# EAGLE design rz568m-test-v1 (EAGLE 7.7.0)
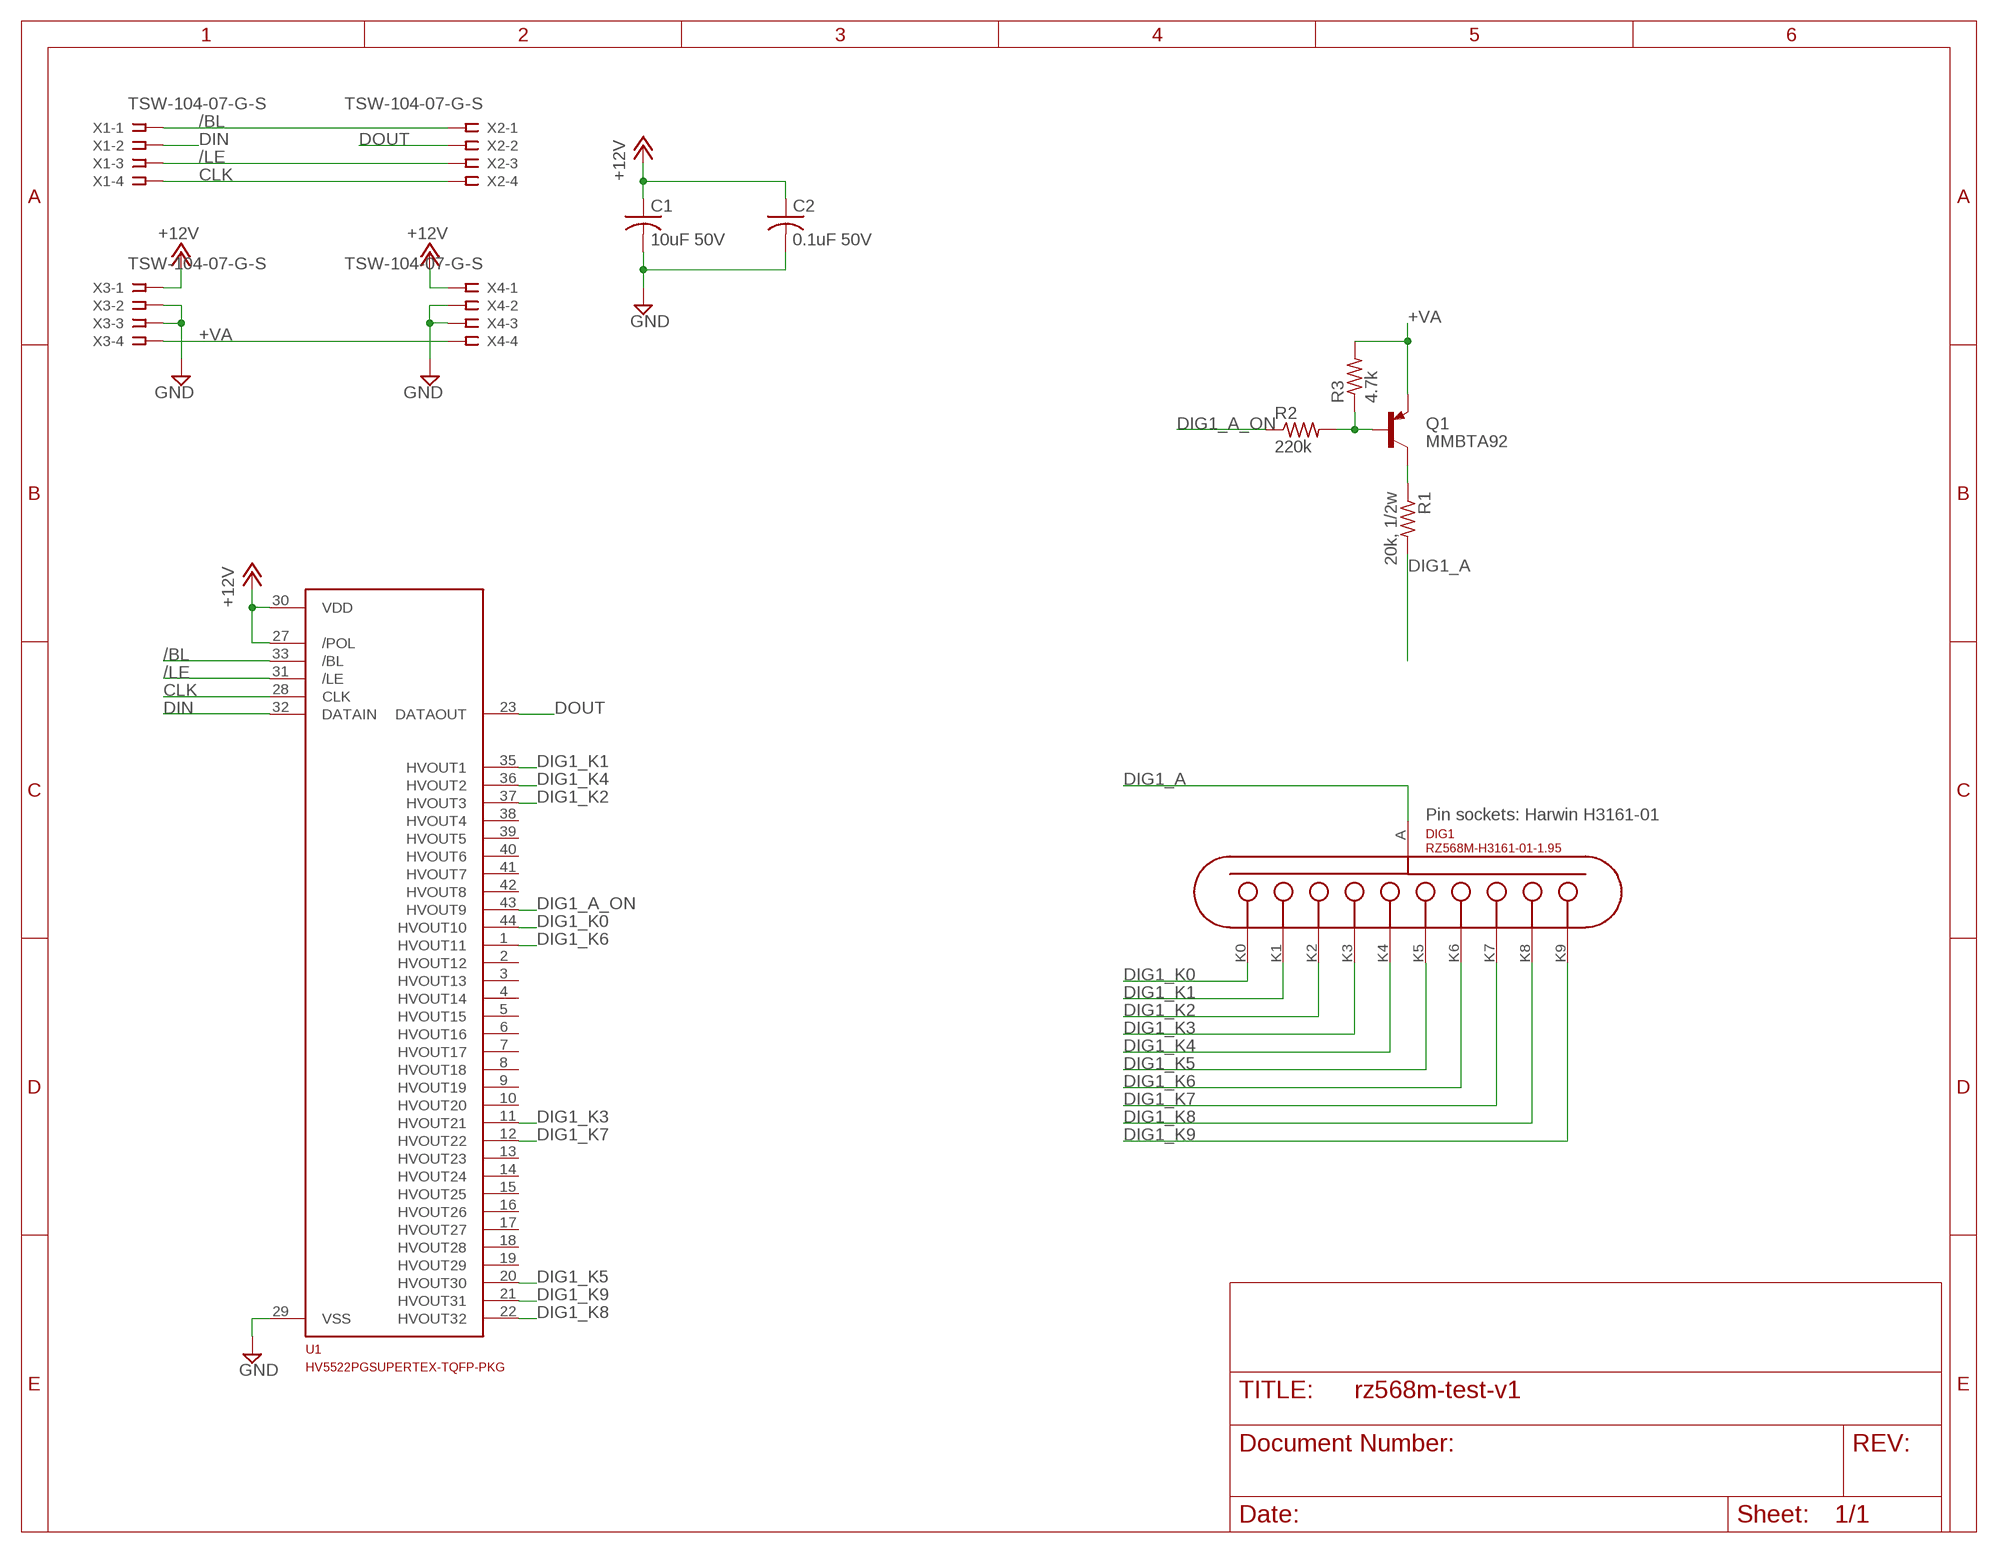
[diagram p0: schematic, sheet 1]

## Parts
C1  10uF 50V  C-USC1210K  [C1210K]
C2  0.1uF 50V  C-USC1206K  [C1206K]
DIG1  RZ568M-H3161-01-1.95  [RZ568M-H3161-01-1.95]
Q1  MMBTA92  MMBTA92LT1-PNP-SOT23-BEC  [SOT23-BEC]
R1  20k, 1/2w  R-US_R1210  [R1210]
R2  220k  R-US_R1206  [R1206]
R3  4.7k  R-US_R1206  [R1206]
U1  HV5522PGSUPERTEX-TQFP-PKG  [TQFP44-HV5522PG]
X1  TSW-104-07-G-S  SSW-104-02-S-S  [SSW-104-02-S-S]
X2  TSW-104-07-G-S  SSW-104-02-S-S  [SSW-104-02-S-S]
X3  TSW-104-07-G-S  SSW-104-02-S-S  [SSW-104-02-S-S]
X4  TSW-104-07-G-S  SSW-104-02-S-S  [SSW-104-02-S-S]

## Nets
+12V: C1.1 C2.1 U1.27(/POL) U1.30(VDD) X3.1 X4.1
+VA: Q1.E R3.2 X3.4 X4.4
/BL: U1.33(/BL) X1.1 X2.1
/LE: U1.31(/LE) X1.3 X2.3
CLK: U1.28(CLK) X1.4 X2.4
DIG1_A: DIG1.A R1.2
DIG1_A_ON: R2.1 U1.43(HVOUT9)
DIG1_BASE: Q1.B R2.2 R3.1
DIG1_COLLECTOR: Q1.C R1.1
DIG1_K0: DIG1.K0 U1.44(HVOUT10)
DIG1_K1: DIG1.K1 U1.35(HVOUT1)
DIG1_K2: DIG1.K2 U1.37(HVOUT3)
DIG1_K3: DIG1.K3 U1.11(HVOUT21)
DIG1_K4: DIG1.K4 U1.36(HVOUT2)
DIG1_K5: DIG1.K5 U1.20(HVOUT30)
DIG1_K6: DIG1.K6 U1.1(HVOUT11)
DIG1_K7: DIG1.K7 U1.12(HVOUT22)
DIG1_K8: DIG1.K8 U1.22(HVOUT32)
DIG1_K9: DIG1.K9 U1.21(HVOUT31)
DIN: U1.32(DATAIN) X1.2
DOUT: U1.23(DATAOUT) X2.2
GND: C1.2 C2.2 U1.29(VSS) X3.2 X3.3 X4.2 X4.3
Unconnected: U1.2(HVOUT12) U1.3(HVOUT13) U1.4(HVOUT14) U1.5(HVOUT15) U1.6(HVOUT16) U1.7(HVOUT17) U1.8(HVOUT18) U1.9(HVOUT19) U1.10(HVOUT20) U1.13(HVOUT23) U1.14(HVOUT24) U1.15(HVOUT25) U1.16(HVOUT26) U1.17(HVOUT27) U1.18(HVOUT28) U1.19(HVOUT29) U1.38(HVOUT4) U1.39(HVOUT5) U1.40(HVOUT6) U1.41(HVOUT7) U1.42(HVOUT8)

## Notes on the sheet
- Pin sockets: Harwin H3161-01

## Library data of the parts
C1 = rcl:C-US: CAPACITOR, American symbol; MFR: KEMET; MFR_PART_NO: C1210C106K5RACTU
C2 = rcl:C-US: CAPACITOR, American symbol; MFR: KEMET; MFR_PART_NO: C1206S104M5RACTU
DIG1 = RZ568M:RZ568M-H3161-01-1.95; MFR: HARWIN; MFR_PART_NO: H3161-01
Q1 = transistor:*-PNP-: PNP Transistror; MFR: ON SEMI; MFR_PART_NO: MMBTA92
R1 = rcl:R-US_: RESISTOR, American symbol; MFR: PANASONIC; MFR_PART_NO: ERJ-14NF2002U
R2 = rcl:R-US_: RESISTOR, American symbol; MFR: PANASONIC; MFR_PART_NO: ERJ-8GEYJ224V
R3 = rcl:R-US_: RESISTOR, American symbol; MFR: PANASONIC; MFR_PART_NO: ERJ-8ENF4701V
U1 = GlenPartsLibrary:HV5522PG; MFR: MICROCHIP; MFR_PART_NO: HV5522PG
X1-X4 = con-samtec:SSW-104-02-S-S: THROUGH-HOLE .025" SQ POST SOCKET Source: Samtec SSW.pdf; MFR: SAMTEC; MFR_PART_NO: TSW-104-07-G-S; MPN: SSW-104-02-S-S; OC_FARNELL: unknown; OC_NEWARK: 11P9384

## Board
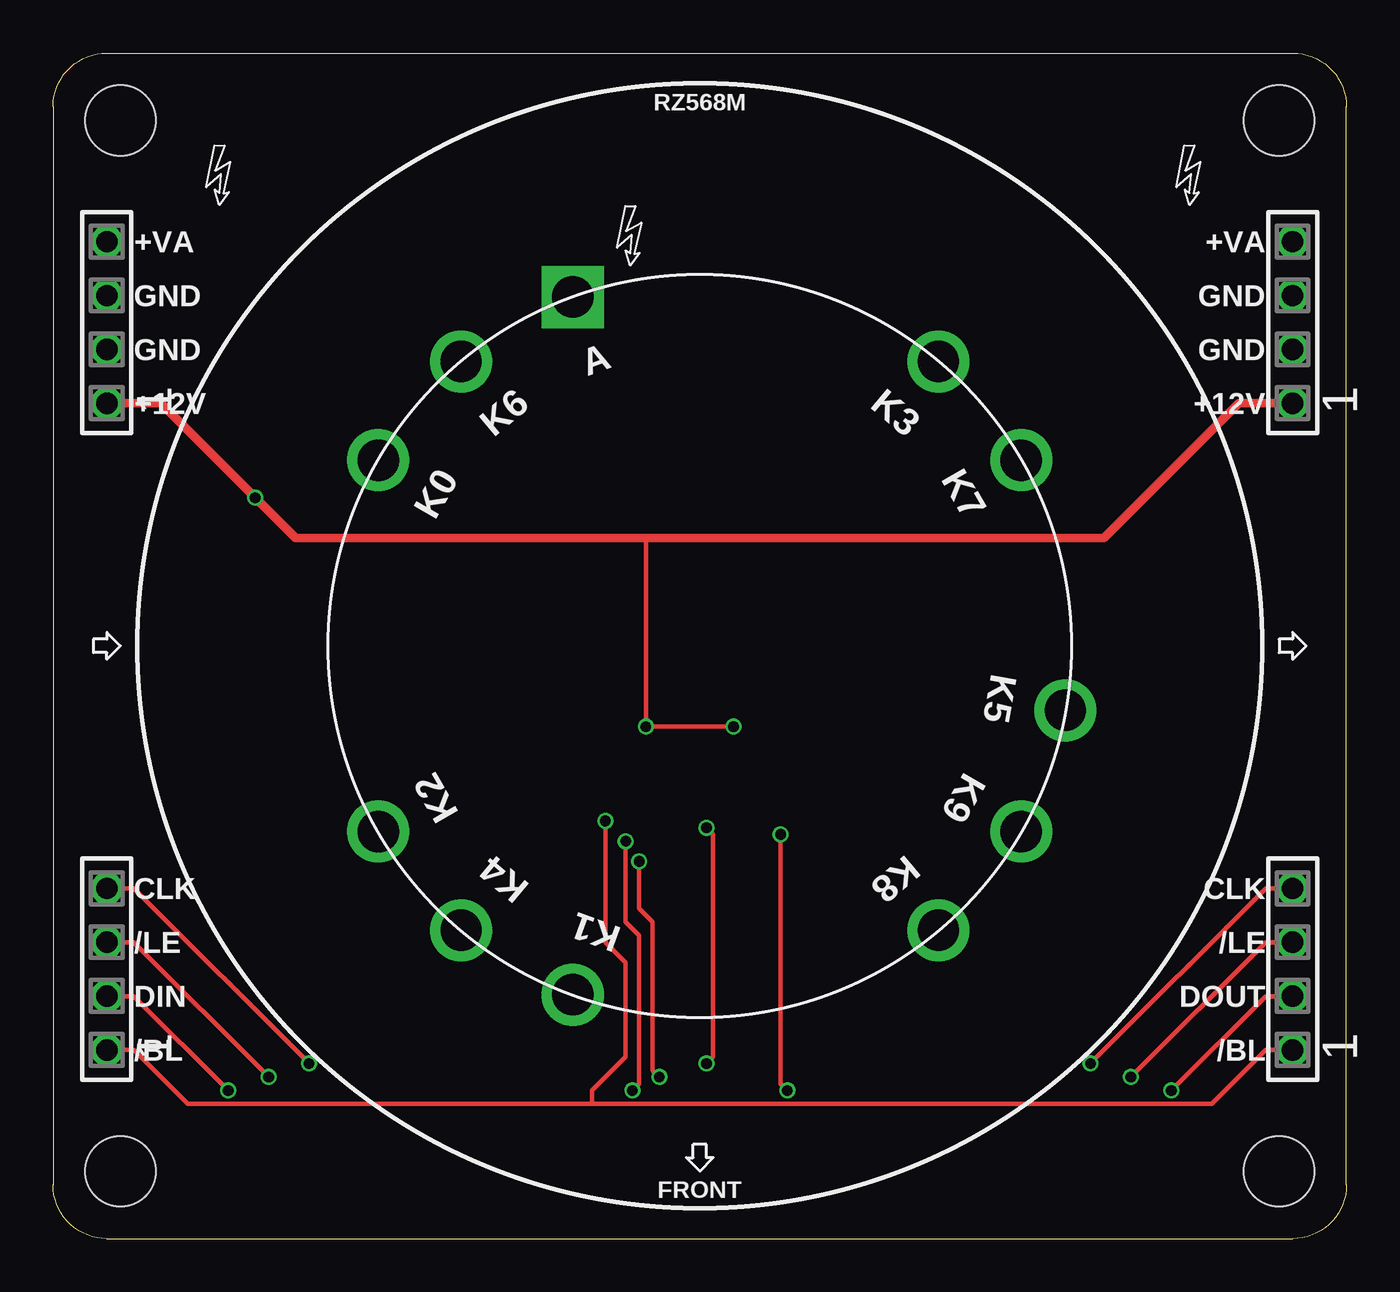
[diagram p1: board, top side]
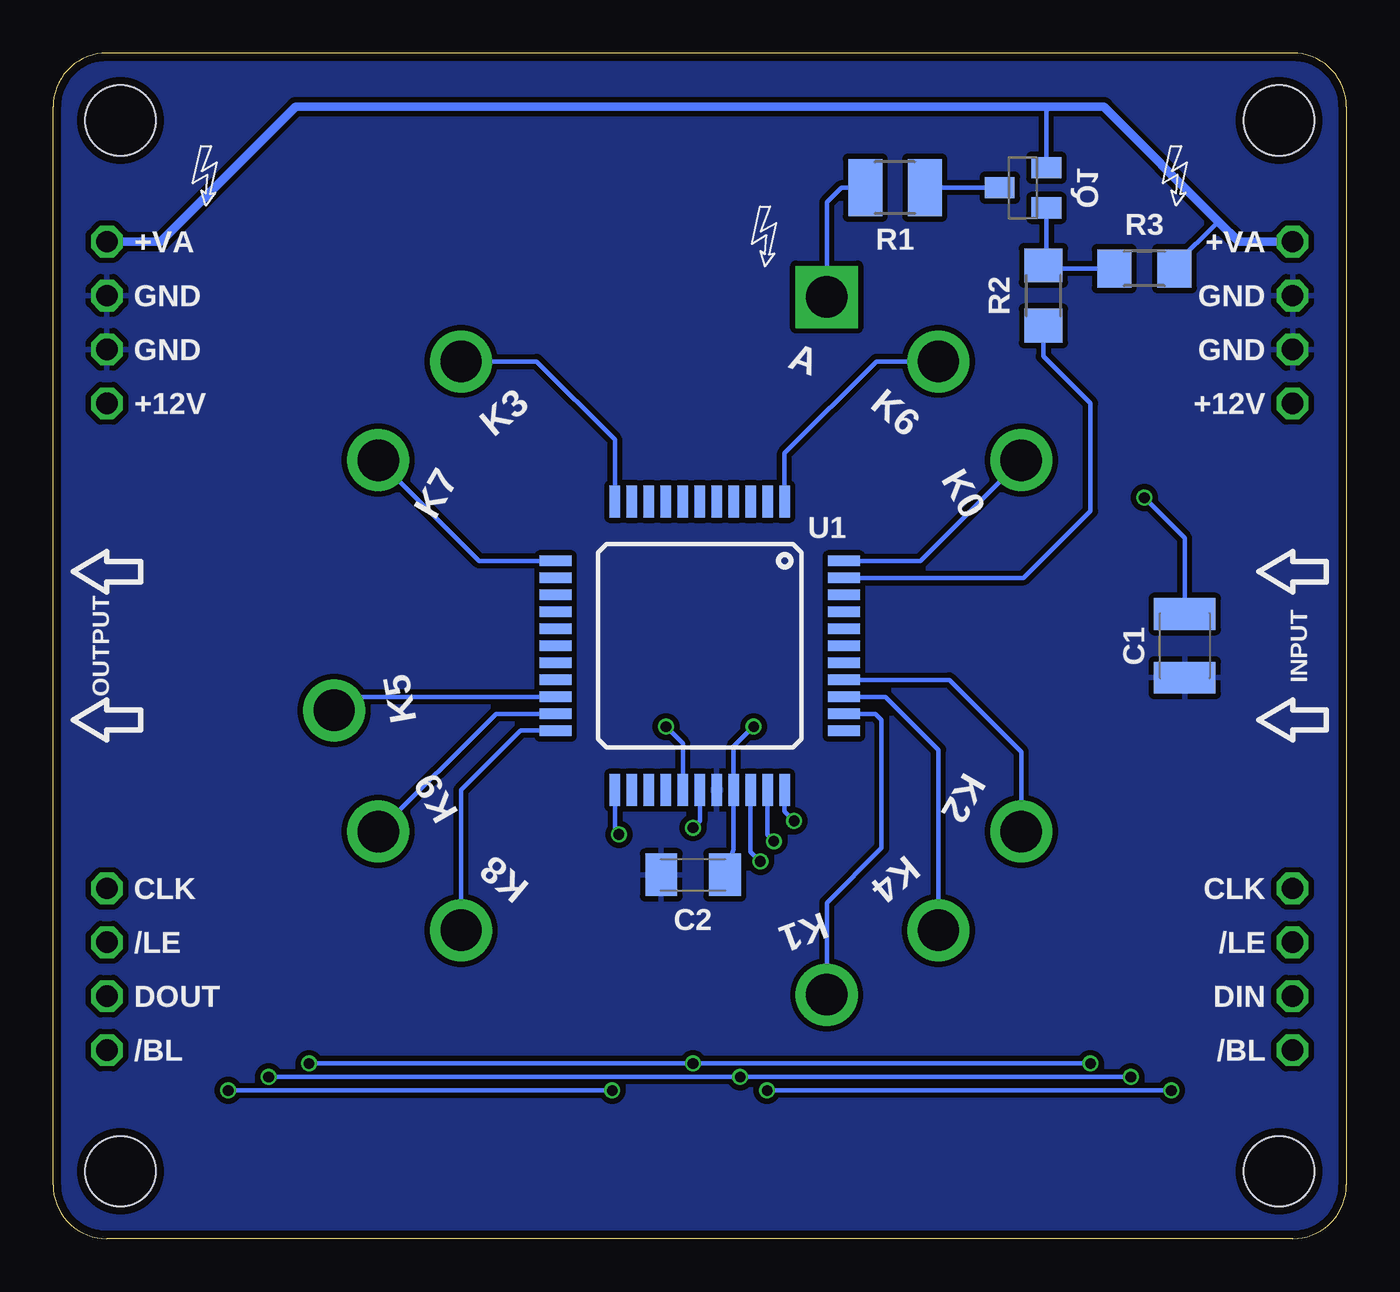
[diagram p2: board, bottom side, seen from below]

Size 60.96 x 55.88 mm. Coordinates in mm from the lower left corner, seen from the top.
Outline: 2.54,0 58.42,0 arc90 60.96,2.54 60.96,53.34 arc90 58.42,55.88 2.54,55.88 arc90 0,53.34 0,2.54 arc90 2.54,0
Copper layers (1*16): Top 0.035559375mm / dielectric 1.6mm / Bottom 0.035559375mm
Design rules "oshpark-2layer-2018": minimum track width 6mil, minimum drill 10mil, track to track 6mil, track to pad 6mil, pad to pad 6mil, via to via 6mil, smd to smd 6mil, copper to edge 15mil, drill to drill 6mil, minimum pad ring 5mil, minimum via ring 5mil, stop-mask expansion 2.5mil, vias tented up to drill 0mil, thermal gap 10mil
Holes 3.3 mm at 3.17,3.17 57.78,3.17 57.78,52.7 3.17,52.7

### Footprints (pad centres in the part's own frame; a part is rotated, then mirrored left to right if it is on the bottom)
C1210K = smd 1.5 x 2.9: 1 -1.5,0; 2 1.5,0
C1206K = smd 1.5 x 2: 1 -1.5,0; 2 1.5,0
RZ568M-H3161-01-1.95 = drill 1.95 square: A -5.985,16.445 | drill 1.95: K0 -15.155,8.75; K1 -5.985,-16.445; K2 -15.155,-8.75; K3 11.249,13.406; K4 -11.249,-13.406; K5 17.234,-3.039; K6 -11.249,13.406; K7 15.155,8.75; K8 11.249,-13.406; K9 15.155,-8.75
SOT23-BEC = smd 1 x 1.4: B -0.95,-1.1; C 0,1.1; E 0.95,-1.1
R1210 = smd 1.6 x 2.7: 1 -1.4,0; 2 1.4,0
R1206 = smd 1.6 x 1.803: 1 -1.422,0; 2 1.422,0
TQFP44-HV5522PG = smd 1.5 x 0.5: 1 -6.8,4; 2 -6.8,3.2; 3 -6.8,2.4; 4 -6.8,1.6; 5 -6.8,0.8; 6 -6.8,0; 7 -6.8,-0.8; 8 -6.8,-1.6; 9 -6.8,-2.4; 10 -6.8,-3.2; 11 -6.8,-4; 23 6.8,-4; 24 6.8,-3.2; 25 6.8,-2.4; 26 6.8,-1.6; 27 6.8,-0.8; 28 6.8,0; 29 6.8,0.8; 30 6.8,1.6; 31 6.8,2.4; 32 6.8,3.2; 33 6.8,4 | smd 0.5 x 1.5: 12 -4,-6.8; 13 -3.2,-6.8; 14 -2.4,-6.8; 15 -1.6,-6.8; 16 -0.8,-6.8; 17 0,-6.8; 18 0.8,-6.8; 19 1.6,-6.8; 20 2.4,-6.8; 21 3.2,-6.8; 22 4,-6.8; 34 4,6.8; 35 3.2,6.8; 36 2.4,6.8; 37 1.6,6.8; 38 0.8,6.8; 39 0,6.8; 40 -0.8,6.8; 41 -1.6,6.8; 42 -2.4,6.8; 43 -3.2,6.8; 44 -4,6.8
SSW-104-02-S-S = drill 1 pad 1.5 octagon: 1 -3.81,0; 2 -1.27,0; 3 1.27,0; 4 3.81,0

### Placement (x,y rotation side)
C1  7.62,27.94 270 bottom
C2  30.8,17.14 180 bottom
DIG1  30.48,27.94 0 top
Q1  15.24,49.53 90 bottom
R1  21.27,49.53 180 bottom
R2  14.29,44.45 90 bottom
R3  9.53,45.72 0 bottom
U1  30.48,27.94 270 bottom
X1  2.54,12.7 90 top
X2  58.42,12.7 90 top
X3  2.54,43.18 90 top
X4  58.42,43.18 90 top

### Tracks (layer width: path | path; a pad name or v marks a point on that pad's centre or on a via)
+12V  (via drill 0.5)
  Top 0.203: 27.94,33.02 v27.94,24.13 v32.07,24.13
  Top 0.406: X4.1 55.88,39.37 49.53,33.02 27.94,33.02 11.43,33.02 v9.53,34.92 5.08,39.37 X3.1
  Bottom 0.203: C1.1 7.62,33.02 v9.53,34.92 | v27.94,24.13 28.88,23.19 U1.30 28.88,18.34 C2.1 | U1.27 31.28,23.33 v32.07,24.13
+VA
  Bottom 0.203: Q1.E 14.14,53.17 13.97,53.34 | R3.2 8.1,45.87 6.03,47.94
  Bottom 0.406: X3.4 5.08,46.99 6.03,47.94 11.43,53.34 13.97,53.34 49.53,53.34 55.88,46.99 X4.4
/BL  (via drill 0.5)
  Top 0.203: 25.4,6.35 6.35,6.35 3.81,8.89 X1.1 | 25.4,6.35 54.61,6.35 57.15,8.89 X2.1 | v26.04,19.68 26.04,13.97 26.99,13.02 26.99,8.57 25.4,6.99 25.4,6.35
  Bottom 0.203: U1.33 26.48,20.13 v26.04,19.68
/LE  (via drill 0.5)
  Top 0.203: v10.16,7.62 3.81,13.97 X1.3 | v50.8,7.62 57.15,13.97 X2.3 | v27.62,17.78 27.62,15.56 28.26,14.92 28.26,7.94 v28.57,7.62
  Bottom 0.203: v10.16,7.62 v28.57,7.62 v50.8,7.62 | U1.31 28.08,18.24 v27.62,17.78
CLK  (via drill 0.5)
  Top 0.203: v12.06,8.26 3.81,16.51 X1.4 | v48.9,8.26 57.15,16.51 X2.4 | v30.8,19.37 31.11,19.05 31.11,8.57 v30.8,8.26
  Bottom 0.203: v12.06,8.26 v30.8,8.26 v48.9,8.26 | U1.28 30.48,19.68 v30.8,19.37
DIG1_A
  Bottom 0.203: R1.2 23.81,49.53 24.5,48.85 DIG1.A
DIG1_A_ON
  Bottom 0.203: U1.43 15.21,31.14 12.06,34.29 12.06,39.37 14.29,41.59 R2.1
DIG1_BASE
  Bottom 0.203: R3.1 14.14,45.72 R2.2 14.14,46.02 Q1.B
DIG1_COLLECTOR
  Bottom 0.203: Q1.C R1.1
DIG1_K0
  Bottom 0.203: U1.44 20.07,31.94 DIG1.K0
DIG1_K1
  Bottom 0.203: U1.35 22.2,24.74 21.91,24.45 21.91,18.41 24.5,15.83 DIG1.K1
DIG1_K2
  Bottom 0.203: U1.37 18.72,26.34 15.32,22.95 DIG1.K2
DIG1_K3
  Bottom 0.203: U1.11 34.48,37.66 38.17,41.35 DIG1.K3
DIG1_K4
  Bottom 0.203: U1.36 21.73,25.54 19.23,23.04 DIG1.K4
DIG1_K5
  Bottom 0.203: U1.20 47.08,25.54 DIG1.K5
DIG1_K6
  Bottom 0.203: U1.1 26.48,37.02 22.15,41.35 DIG1.K6
DIG1_K7
  Bottom 0.203: U1.12 40.88,31.94 DIG1.K7
DIG1_K8
  Bottom 0.203: U1.22 38.92,23.94 41.73,21.14 DIG1.K8
DIG1_K9
  Bottom 0.203: U1.21 40.09,24.74 DIG1.K9
DIN  (via drill 0.5)
  Top 0.203: v8.26,6.99 3.81,11.43 X1.2 | v26.99,18.73 26.99,14.92 27.62,14.29 27.62,7.3 v27.3,6.99
  Bottom 0.203: v8.26,6.99 v27.3,6.99 | U1.32 27.28,19.02 v26.99,18.73
DOUT  (via drill 0.5)
  Top 0.203: v52.7,6.99 57.15,11.43 X2.2 | v34.29,19.05 34.29,7.3 v34.61,6.99
  Bottom 0.203: v52.7,6.99 v34.61,6.99 | U1.23 34.48,19.24 v34.29,19.05
GND
  pour Bottom (isolate 0.254): 0,55.88 60.96,55.88 60.96,0 0,0

### Text on the board
_tsilk: RZ568M | +VA | +VA | GND | GND | GND | A | GND | +12V | K6 | K3 | +12V | K0 | K7 | K5 | K2 | K9 | CLK | CLK | K4 | K8 | /LE | K1 | /LE | DIN | DOUT | /BL | /BL | FRONT
_bsilk: Q1 | R1 | +VA | R3 | +VA | GND | R2 | GND | GND | A | GND | +12V | K6 | K3 | +12V | K0 | K7 | U1 | INPUT | C1 | OUTPUT | K5 | K2 | K9 | CLK | CLK | K4 | C2 | K8 | /LE | K1 | /LE | DIN | DOUT | /BL | /BL